# Altium project MSXIV_DC-DC_Converter.PrjPcb
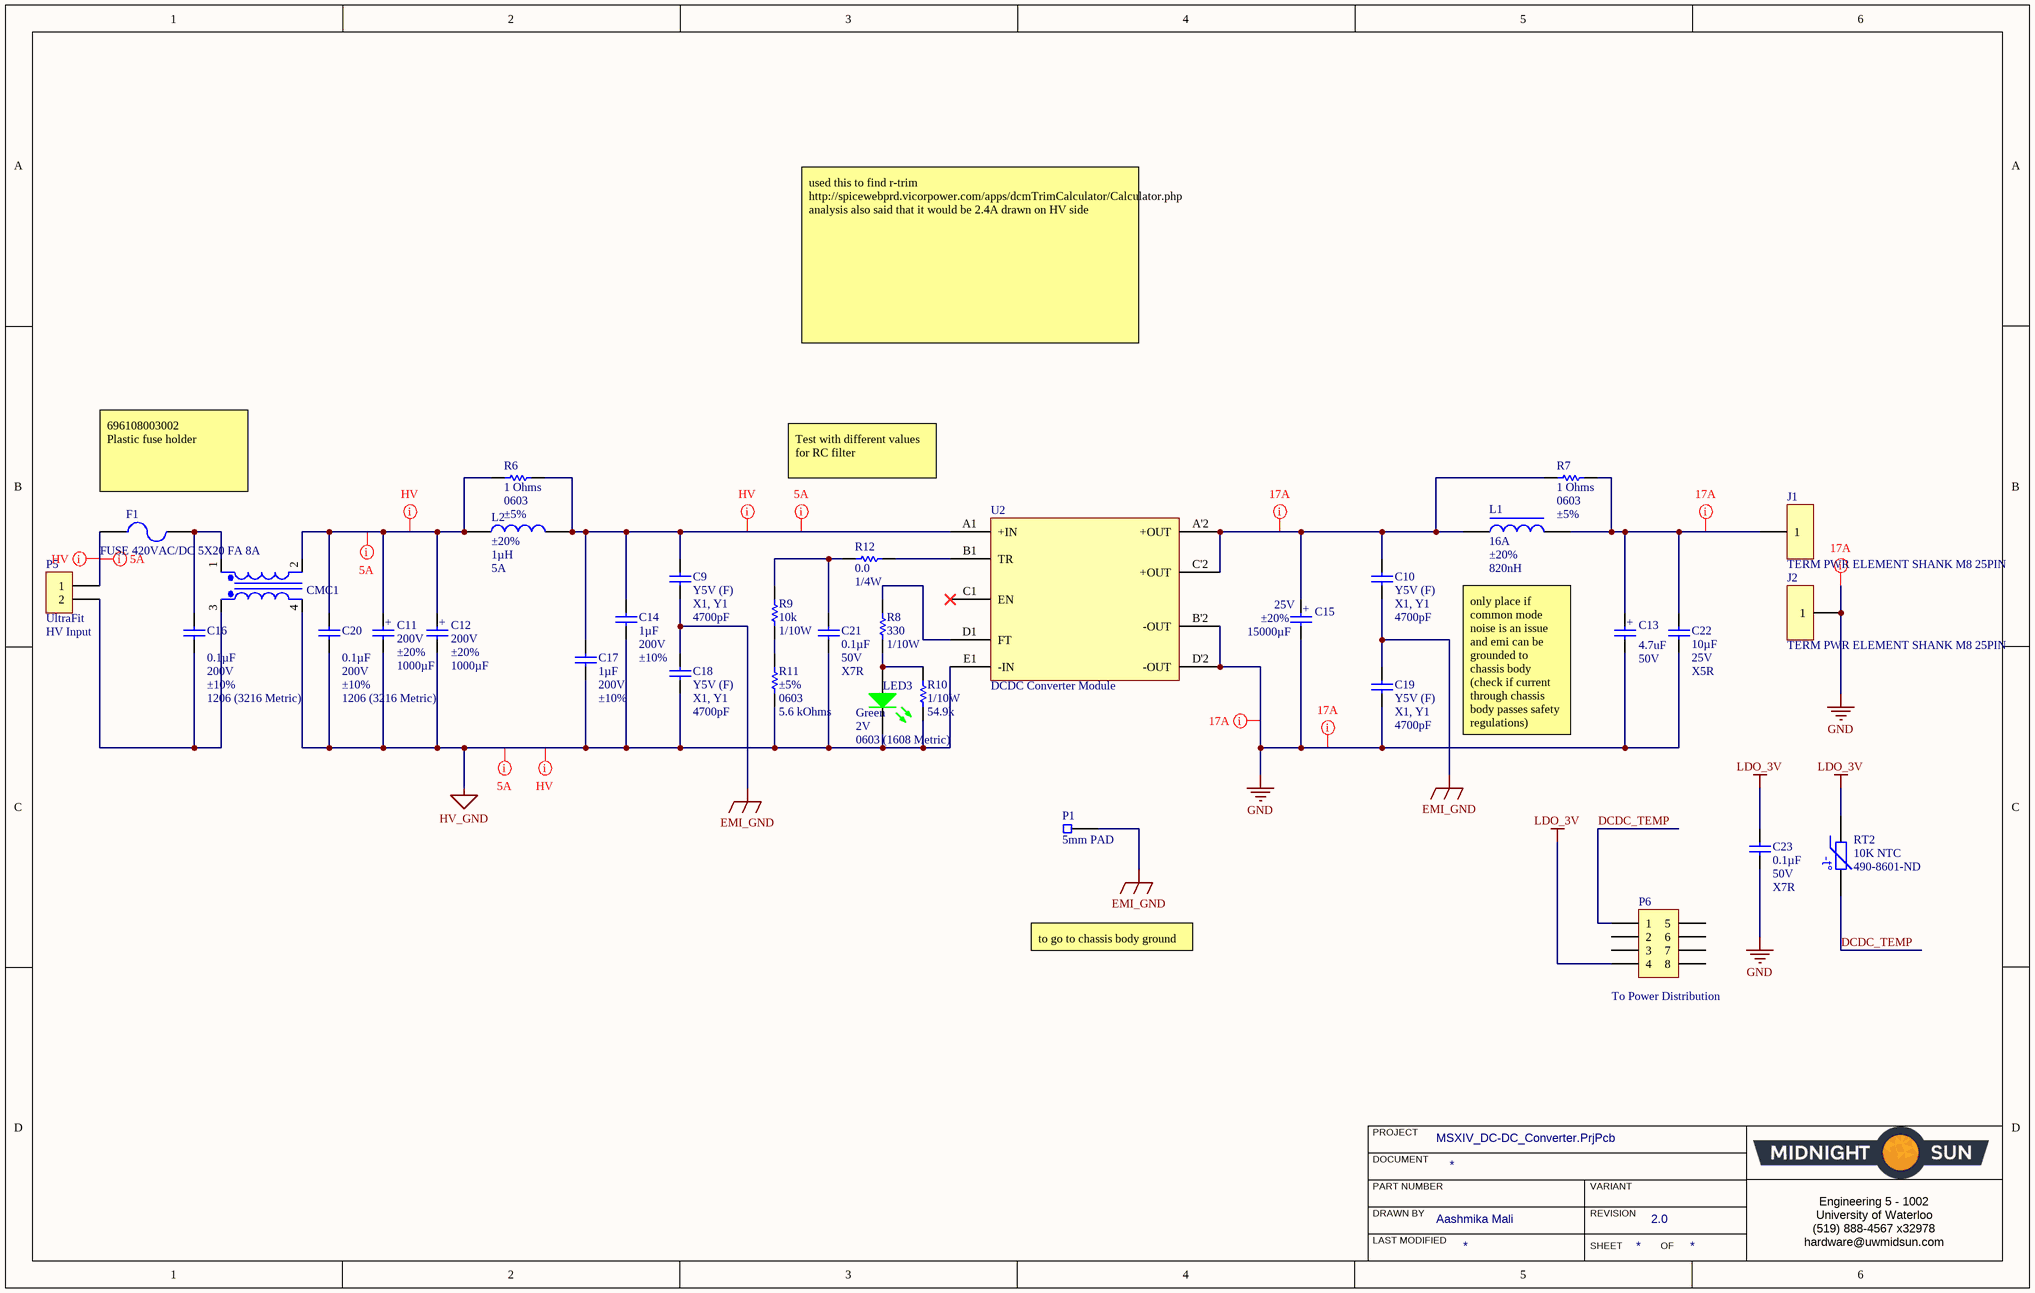
[diagram p0: MSXIV_DC-DC_Converter.SchDoc]
ProjectAuthor: Aashmika Mali; ProjectRevision: 2.0
1 sheet, 34 parts. Net scope: global (net labels, ports and power ports of the same name join across sheets).
Board file: MSXIV_DC-DC_Converter.PcbDoc

## Sheet MSXIV_DC-DC_Converter.SchDoc
size B

### Parts
C9  value 4700pF  Temperature Coefficient: Y5V (F)  Ratings: X1, Y1  [CAP 4700PF 400VAC Y5V RADIAL]  (hidden comment: CAP CER 4700PF 400VAC Y5V RADIAL)
C10  value 4700pF  Temperature Coefficient: Y5V (F)  Ratings: X1, Y1  [CAP 4700PF 400VAC Y5V RADIAL]  (hidden comment: CAP CER 4700PF 400VAC Y5V RADIAL)
C11  Voltage - Rated: 200V  Tolerance: ±20%  Capacitance: 1000µF  [CAP ALUM 1000uF 200V]  (hidden comment: CAP ALUM 1000UF 20% 200V SNAP)
C12  Voltage - Rated: 200V  Tolerance: ±20%  Capacitance: 1000µF  [CAP ALUM 1000uF 200V]  (hidden comment: CAP ALUM 1000UF 20% 200V SNAP)
C13  Capacitance: 4.7uF  Voltage Rating (DC): 50V  [CAP ALUM 6.3MM RADIAL SMD]  (hidden comment: EEE-1HA4R7NP)
C14  Capacitance: 1µF  Voltage - Rated: 200V  Tolerance: ±10%  [CAP, 2220]  (hidden comment: CAP CER 1UF 200V X7R 2220)
C15  Voltage - Rated: 25V  Tolerance: ±20%  Capacitance: 15000µF  [CAP ALUM 1000uF 200V]  (hidden comment: CAP ALUM 15000UF 20% 25V SNAP)
C16  Capacitance: 0.1µF  Voltage - Rated: 200V  Tolerance: ±10%  Package / Case: 1206 (3216 Metric)  [CAP, 1206]  (hidden comment: CAP CER 0.1UF 200V X7R 1206)
C17  Capacitance: 1µF  Voltage - Rated: 200V  Tolerance: ±10%  [CAP, 2220]  (hidden comment: CAP CER 1UF 200V X7R 2220)
C18  value 4700pF  Temperature Coefficient: Y5V (F)  Ratings: X1, Y1  [CAP 4700PF 400VAC Y5V RADIAL]  (hidden comment: CAP CER 4700PF 400VAC Y5V RADIAL)
C19  value 4700pF  Temperature Coefficient: Y5V (F)  Ratings: X1, Y1  [CAP 4700PF 400VAC Y5V RADIAL]  (hidden comment: CAP CER 4700PF 400VAC Y5V RADIAL)
C20  Capacitance: 0.1µF  Voltage - Rated: 200V  Tolerance: ±10%  Package / Case: 1206 (3216 Metric)  [CAP, 1206]  (hidden comment: CAP CER 0.1UF 200V X7R 1206)
C21  Capacitance: 0.1µF  Voltage: 50V  Temperature Coefficient: X7R  [CAP, 0603]  (hidden comment: CAP CER 0.1UF 50V 10% X7R 0603)
C22  Capacitance: 10µF  Voltage: 25V  Temperature Coefficient: X5R  [CAP, 0603]  (hidden comment: CAP CER 10uF 25V 20% X5R 0603)
C23  Capacitance: 0.1µF  Voltage: 50V  Temperature Coefficient: X7R  [CAP, 0603]  (hidden comment: CAP CER 0.1UF 50V 10% X7R 0603)
CMC1  CM Choke  [LCCI 50 Common mode choke]  (value not drawn)
F1  FUSE 420VAC/DC 5X20 FA 8A  [FUSE 420VAC/DC 5X20 FA 8A]
J1  TERM PWR ELEMENT SHANK M8 25PIN  [TERM PWR ELEMENT SHANK M8 25PIN]
J2  TERM PWR ELEMENT SHANK M8 25PIN  [TERM PWR ELEMENT SHANK M8 25PIN]
L1  Current Rating (Amps): 16A  Tolerance: ±20%  Inductance: 820nH  [IND 820NH 16A 6 MOHM SMD]  (hidden comment: IND 820NH 16A 6 MOHM SMD)
L2  Tolerance: ±20%  Inductance: 1µH  Current Rating (Amps): 5A  [IND 1UH 5A 12MOHM SMD]  (hidden comment: IND 1UH 5A 12MOHM SMD)
LED3  Package / Case: 0603 (1608 Metric)  Color: Green  Voltage - Forward (Vf) (Typ): 2V  [LED_0603]  (hidden comment: LED GREEN CLEAR 2V 0603)
P1  5mm PAD  [5mm PAD]
P5  Series: UltraFit  [CONN, 2POS ULTRA-FIT]  (hidden comment: CONN 2POS ULTRA-FIT 0.138")
P6  CONN 8POS ULTRA-FIT 0.138"  [CONN, 8POS ULTRA-FIT]  (value not drawn)
R6  Resistance: 1 Ohms  Supplier Device Package: 0603  Tolerance: ±5%  [RES, 0603]  (hidden comment: RES 1 OHM 5% 1/10W 0603)
R7  Resistance: 1 Ohms  Supplier Device Package: 0603  Tolerance: ±5%  [RES, 0603]  (hidden comment: RES 1 OHM 5% 1/10W 0603)
R8  Resistance: 330  Power: 1/10W  [RES, 0603]  (hidden comment: RES 330 OHM 1% 1/10W 0603)
R9  Resistance: 10k  Power: 1/10W  [RES, 0603]  (hidden comment: RES 10K OHM 1% 1/10W 0603)
R10  Power (Watts): 1/10W  Resistance (Ohms): 54.9k  [RES, 0603]  (hidden comment: RES 54.9K OHM 1% 1/10W 0603)
R11  Tolerance: ±5%  Supplier Device Package: 0603  Resistance: 5.6 kOhms  [RES, 0603]  (hidden comment: RES 15.6K OHM 0.1% 1/10W 0402)
R12  Resistance: 0.0  Power (Watts): 1/4W  [RES, 0603]  (hidden comment: RES 0.0 OHM 1/4W 0603)
RT2  10K NTC  Supplier Part Number 1: 490-8601-ND  [NTC THERMISTOR BEAD]
U2  Type: DCDC Converter Module  [IC, DCDC converter DCM3623TA5N17B4T70]  (hidden comment: DCDC VICOR CONVERTER 15V 240W - DCM3623TA5N17B4T70)

### Nets
EMI_GND: C9.2 C10.2 C18.1 C19.1 P1.1
GND: C13.2 C15.2 C19.2 C22.2 C23.2 J2.1 U2.B'2(-OUT) U2.D'2(-OUT)
HV_GND: C11.2 C12.2 C14.2 C17.2 C18.2 C20.2 C21.2 CMC1.4 LED3.2(K) R10.2 R11.1 U2.E1(-IN)
LDO_3V: C23.1 P6.4 RT2.1
DCDC_TEMP: P6.1 RT2.2
NetC9_1: C9.1 C14.1 C17.1 L2.2 R6.2 U2.A1(+IN)
NetC10_1: C10.1 C15.1 L1.1 R7.1 U2.A'2(+OUT) U2.C'2(+OUT)
NetC11_1: C11.1 C12.1 C20.1 CMC1.2 L2.1 R6.1
NetC13_1: C13.1 C22.1 J1.1 L1.2 R7.2
NetC16_1: C16.1 CMC1.1 F1.2
NetC16_2: C16.2 CMC1.3 P5.2
NetC21_1: C21.1 R9.1 R12.1
NetF1_1: F1.1 P5.1
NetLED3_1: LED3.1(A) R8.2 R10.1
NetR8_1: R8.1 U2.D1(FT)
NetR9_2: R9.2 R11.2
NetR12_2: R12.2 U2.B1(TR)

Not connected (* = marked no-connect by the designer): P6 2 3 5 6 7 8; U2 C1(EN)*

### Layout directives
net class HV: HV_GND, NetC9_1, NetC11_1, NetF1_1
net class 5A: HV_GND, NetC9_1, NetC11_1, NetF1_1
net class 20A: GND, NetC10_1, NetC13_1

### Notes on the sheet
- used this to find r-trim http://spicewebprd.vicorpower.com/apps/dcmTrimCalculator/Calculator.php
  analysis also said that it would be 2.4A drawn on HV side
- (near F1) 696108003002
  Plastic fuse holder
- Test with different values for RC filter
- (near P5) HV Input
- only place if common mode noise is an issue and emi can be grounded to chassis body (check if current through chassis body passes safety regulations)
- to go to chassis body ground
- (near P6) To Power Distribution
- PROJECT
- DOCUMENT
- DRAWN BY
- LAST MODIFIED
- PART NUMBER
- REVISION
- SHEET
- VARIANT
- OF
- Engineering 5 - 1002
  University of Waterloo
  (519) 888-4567 x32978
  hardware@uwmidsun.com
- (in symbol CAP ALUM 4.7UF 20% 50V SMD) +
- (in symbol CAP ALUM 1000UF 20% 200V SNAP) +
- (in symbol CAP ALUM 15000UF 20% 25V SNAP) +
- (in symbol NTC THERMISTOR 10K 1% BEAD) -t°

### Library data of the parts
C9 C10 C18 C19 = CAP CER 4700PF 400VAC Y5V RADIAL: 4700pF ±20% 400VAC Ceramic Capacitor Y5V (F) Radial, Disc; Manufacturer: KEMET; Manufacturer Part Number: C951U472MVVDBA7317; Supplier 1: Digi-Key; RoHS: RoHS Compliant; Category: Capacitors; Stock 1: 9713; Pricing 1: 1=1.12, 10=0.795, 100=0.5234, 500=0.38772 (CAD); Packaging: Cut Tape (CT); Part Status: Active; Tolerance: ±20%; Voltage - Rated: 400VAC; Operating Temperature: -40°C ~ 125°C; Features: -; Applications: Safety; Failure Rate: -; Mounting Type: Through Hole; Package / Case: Radial, Disc; Size / Dimension: 0.472" Dia (12.00mm); Height - Seated (Max): -; Thickness (Max): -; Lead Spacing: 0.394" (10.00mm); Lead Style: Formed Leads - Kinked; ComponentLink1URL: https://search.kemet.com/component-edge/download/datasheet/C951U472MVVDBA7317.pdf; ComponentLink1Description: https://search.kemet.com/component-edge/download/datasheet/C951U472MVVDBA7317.pdf; Supplier Part Number 1: 399-9517-1-ND
C11 C12 = CAP ALUM 1000UF 20% 200V SNAP: CAP RADIAL ALUM 1000UF 20% 200V SNAP; Manufacturer 1: Cornell Dubilier Electronics (CDE); Manufacturer Part Number 1: SLPX102M200C4P3; ESR (Equivalent Series Resistance): 199mOhm @ 120Hz; Polarization: Polar; Supplier 1: Digi-Key; Supplier Part Number 1: 338-1557-ND; Mounting Type: Through Hole; Package / Case: Radial, Can - Snap-In
C13 = CAP ALUM 4.7UF 20% 50V SMD: 4.7µF 50V Aluminum Electrolytic Capacitors Radial, Can - SMD 2000 Hrs @ 85°C; Manufacturer 1: Panasonic; Description 1: CAPACITOR ALUM ELEC, 4.7UF, 50V, 20%, SMD; Ripple Current: 31mA; Tolerance: 20%; Life (Hours): 2000Hour; Supplier 1: Digi-Key; Supplier Part Number 1: PCE4304CT-ND; Manufacturer Part Number 1: EEE-1HA4R7NP; Stock 1: 19771; Pricing 1: 1=0.43, 10=0.302, 100=0.1986, 500=0.1471 (USD); Mount: Surface Mount,PCB; Case/Package: Radial; Min Operating Temperature: -40°C; Max Operating Temperature: 85°C; Voltage Rating: 50V; Ripple Current (AC): 31mA; Packaging: Tape and Reel; Package Quantity: 1; Termination: SMD/SMT; Diameter: 6.3mm; Length: 5.5mm; Height: 5.4mm; Height - Seated (Max): 0.213inch; Width: 650um; Radiation Hardening: No; REACH SVHC: No SVHC; Lead Free: Lead Free; ComponentLink1URL: https://datasheet.ciiva.com/46374/aba0000ce2-46374373.pdf; ComponentLink1Description: https://datasheet.ciiva.com/46374/aba0000ce2-46374373.pdf; ComponentLink2URL: https://datasheet.ciiva.com/14600/70255710-14600343.pdf; ComponentLink2Description: https://datasheet.ciiva.com/14600/70255710-14600343.pdf; ComponentLink3URL: https://datasheet.ciiva.com/17536/aba0000ce2-17536647.pdf; ComponentLink3Description: https://datasheet.ciiva.com/17536/aba0000ce2-17536647.pdf; ComponentLink4URL: https://datasheet.ciiva.com/24027/aba0000ce2-40801-24027083.pdf; ComponentLink4Description: https://datasheet.ciiva.com/24027/aba0000ce2-40801-24027083.pdf; ComponentLink5URL: https://datasheet.ciiva.com/31414/aba0000ce2-31414684.pdf; ComponentLink5Description: https://datasheet.ciiva.com/31414/aba0000ce2-31414684.pdf; ComponentLink6URL: https://datasheet.ciiva.com/14606/70255710-14606079.pdf; ComponentLink6Description: https://datasheet.ciiva.com/14606/70255710-14606079.pdf
C14 C17 = CAP CER 1UF 200V X7R 2220: 1µF ±10% 200V Ceramic Capacitor X7R 2220 (5750 Metric); Manufacturer: Murata Electronics; Manufacturer Part Number 1: GRM55DR72D105KW01L; Mounting Type 1: Surface Mount, MLCC; Supplier 1: Digi-Key; Supplier Part Number 1: 490-14683-1-ND; Temperature Coefficient: X7R; Package / Case: 2220 (5750 Metric); Size / Dimension: 0.224" L x 0.197" W (5.70mm x 5.00mm)
C15 = CAP ALUM 15000UF 20% 25V SNAP: 15000µF 25V Aluminum Electrolytic Capacitors Radial, Can - Snap-In 40mOhm 3000 Hrs @ 105°C; Manufacturer: Cornell Dubilier Electronics (CDE); Manufacturer Part Number: SLP153M025C4P3; Parameter 1: 0.984" Dia (25.00mm); Supplier 1: Digi-Key; Supplier Part Number 1: 338-1470-ND; Size / Dimension: 0.984" Dia (25.00mm)
C16 C20 = CAP CER 0.1UF 200V X7R 1206: Manufacturer 1: Manufacturer; Manufacturer Part Number 1: 885342208002; Supplier 1: Digi-Key; Supplier Part Number 1: 732-12081-1-ND; Temperature Coefficient: X7R
C21 C23 = CAP CER 0.1UF 50V 10% X7R 0603: 0.10µF ±10% 50V Ceramic Capacitor X7R 0603 (1608 Metric); Manufacturer 1: AVX Corporation; Manufacturer Part Number 1: 06035C104KAT2A; Supplier 1: Digi-Key; Supplier Part Number 1: 478-5052-1-ND; Packaging: Cut Tape (CT); Part Status: Active; Operating Temperature: -55°C ~ 125°C; Ratings: -; Mounting Type: Surface Mount, MLCC; Package / Case: 0603 (1608 Metric); Size / Dimension: 0.063" L x 0.032" W (1.60mm x 0.81mm); Height - Seated (Max): -; Thickness (Max): 0.035" (0.90mm); Lead Spacing: -; Lead Style: -; ComponentLink1URL: http://datasheets.avx.com/X7RDielectric.pdf; ComponentLink1Description: http://datasheets.avx.com/X7RDielectric.pdf; Tolerance: ±10%
C22 = CAP CER 10uF 25V 20% X5R 0603: 10µF ±20% 25V Ceramic Capacitor X5R 0603 (1608 Metric); Manufacturer 1: Murata Electronics North America; Manufacturer Part Number 1: GRM188R61E106MA73D; Supplier 1: Digi-Key; Supplier Part Number 1: 490-7202-1-ND; Packaging: Cut Tape (CT); Part Status: Active; Operating Temperature: -55°C ~ 85°C; Ratings: -; Mounting Type: Surface Mount, MLCC; Package / Case: 0603 (1608 Metric); Size / Dimension: 0.063" L x 0.031" W (1.60mm x 0.80mm); Height - Seated (Max): -; Thickness (Max): 0.031" (0.80mm); Lead Spacing: -; Lead Style: -; ComponentLink1URL: http://www.murata.com/~/media/webrenewal/support/library/catalog/products/capacitor/mlcc/c02e.ashx; ComponentLink1Description: http://www.murata.com/~/media/webrenewal/support/library/catalog/products/capacitor/mlcc/c02e.ashx; Tolerance: ±20%
CMC1 = COMMON MODE CHOKE 5.6A 2LN SMD: 2 Line Common Mode Choke Surface Mount  5.6A DCR 21mOhm; PartNumber: P0353NL; Manufacturer 1: Pulse Electronics Power; Manufacturer Part Number 1: P0353NLT; Filter Type: Power Line; Number of Lines: 2; Package: TBD; Supplier 1: Digi-Key; Supplier Part Number 1: 553-1764-1-ND; Current Rating (Max): 5.6A; DC Resistance (DCR) (Max): 21mOhm
F1 = FUSE 420VAC/DC 5X20 FA 8A: 8A 420V AC 420V DC Fuse Cartridge, Ceramic Holder Cartridge, Non-Standard; Manufacturer Part Number: 0487008.MXP; Manufacturer: Littelfuse Inc.; Supplier 1: Digi-Key; Supplier Part Number 1: F6659-ND; Fuse Type: Cartridge, Ceramic; Voltage Rating - DC: 420V
J1 J2 = TERM PWR ELEMENT SHANK M8 25PIN: 25 Pin Shank Terminal M8 Through Hole; Manufacturer Part Number 1: 7460719; Manufacturer 1: Wurth Electronics Inc.; Current Rating (Amps): 250A; Supplier 1: Digi-Key; Supplier Part Number 1: 732-3219-ND; Terminal Type: Shank Terminal; Screw Size: M8; Termination: Press-Fit; Number of Pins: 25
L1 = IND 820NH 16A 6 MOHM SMD: 820nH Shielded Molded Inductor 16A 6mOhm Max Nonstandard; Manufacturer Part Number: ECS-MPIL0630-R82MC; Manufacturer: ECS Inc.; Supplier 1: Digi-Key; Supplier Part Number 1: XC2399CT-ND; Package / Case: Nonstandard; Shielding: Shielded; DC Resistance (DCR): 6mOhm Max; Mounting Type: Surface Mount; Size / Dimension: 0.291" L x 0.260" W (7.40mm x 6.60mm); Height - Seated (Max): 0.118" (3.00mm)
L2 = IND 1uH 5A 12MOHM SMD: 1µH Semi-Shielded Wirewound Inductor 5A 12mOhm Nonstandard; Manufacturer 1: Bourns Inc.; Manufacturer Part Number 1: SRN5040TA-1R0M; Current - Saturation: 7.5A; Shielding: Semi-Shielded; DC Resistance (DCR): 12mOhm; Mounting Type: Surface Mount; Package / Case: Nonstandard; Supplier 1: Digi-Key; Supplier Part Number 1: SRN5040TA-1R0MCT-ND
LED3 = LED GREEN CLEAR 2V 0603: Green 572nm LED Indication - Discrete 2V 0603 (1608 Metric); Manufacturer: Wurth Electronics Inc.; Manufacturer Part Number: 150060VS75000; Lens Color: Colorless; Millicandela Rating: 40mcd; Lens Style/Size: Rectangle with Flat Top, 1.10mm x 0.70mm; Current - Test: 20mA; Viewing Angle: 140°; Wavelength - Dominant: 570nm; Supplier 1: Digi-Key; RoHS: RoHS Compliant; Category: Optoelectronics; Stock 1: 9408; Pricing 1: 1=0.21, 100=0.1617, 500=0.13964 (CAD); Packaging: Cut Tape (CT); Part Status: Active; Lens Transparency: Clear; Mounting Type: Surface Mount; Wavelength - Peak: 572nm; Features: -; Supplier Device Package: 0603; Size / Dimension: 1.60mm L x 0.80mm W; Height (Max): 0.80mm; ComponentLink1URL: http://katalog.we-online.de/led/datasheet/150060VS75000.pdf; ComponentLink1Description: http://katalog.we-online.de/led/datasheet/150060VS75000.pdf; Supplier Part Number 1: 732-4980-1-ND
P1 = 5mm PAD: 5x5mm pad to solder 16 gauge wire
P5 = CONN 2POS ULTRA-FIT 0.138": 2 Positions Header, Shrouded Connector 0.138" (3.50mm) Through Hole Gold; Manufacturer 1: Molex, LLC; Manufacturer Part Number 1: 1722861302; Style: Board to Board or Cable; Shrouding: Shrouded - 4 Wall; Number of Positions: 2; Number of Positions Loaded: All; Contact Length - Post: 0.126" (3.20mm); Material Flammability Rating: UL94 V-0; Mated Stacking Heights: 26.99mm; Voltage: 400V; Supplier 1: Digi-Key; Supplier Part Number 1: WM11673-ND; Packaging: Tray; Part Status: Active; Connector Type: Header; Contact Type: Male Pin; Pitch - Mating: 0.138" (3.50mm); Number of Rows: 1; Row Spacing - Mating: -; Mounting Type: Through Hole; Termination: Kinked Pin, Solder; Fastening Type: Latch Holder; Contact Length - Mating: -; Overall Contact Length: -; Insulation Height: 0.465" (11.80mm); Contact Shape: Square; Contact Finish - Mating: Gold; Contact Finish Thickness - Mating: 30µin (0.76µm); Contact Finish - Post: Tin; Contact Material: Copper Alloy; Insulation Material: Liquid Crystal Polymer (LCP); Operating Temperature: -40°C ~ 120°C; Ingress Protection: -; Insulation Color: Black; Current Rating: -; Contact Finish Thickness - Post: 60µin (1.52µm); ComponentLink1URL: http://www.molex.com/pdm_docs/sd/1722861302_sd.pdf; ComponentLink1Description: http://www.molex.com/pdm_docs/sd/1722861302_sd.pdf
P6 = CONN 8POS ULTRA-FIT 0.138": 8 Positions Header Connector 0.138" (3.50mm) Through Hole Tin; Manufacturer: Molex, LLC; Manufacturer Part Number: 1722991108; Style: Board to Cable/Wire; Shrouding: Shrouded - 4 Wall; Number of Positions: 8; Number of Positions Loaded: All; Row Spacing - Mating: 0.181" (4.60mm); Contact Length - Post: 0.126" (3.20mm); Material Flammability Rating: UL94 V-0; Voltage Rating: 400V; Mated Stacking Heights: 26.99mm; Supplier 1: Digi-Key; RoHS: RoHS Compliant; Category: Connectors, Interconnects; Stock 1: 60; Pricing 1: 1=2.12, 10=1.923, 50=1.7262, 100=1.6478, 250=1.49084, 500=1.37314, 1000=1.17697, 2500=1.0985, 5000=1.04358 (CAD); Packaging: Tray; Part Status: Active; Connector Type: Header; Contact Type: Male Pin; Pitch - Mating: 0.138" (3.50mm); Number of Rows: 2; Mounting Type: Through Hole; Termination: Solder; Fastening Type: Latch Holder; Contact Length - Mating: -; Overall Contact Length: -; Insulation Height: 0.465" (11.80mm); Contact Shape: Square; Contact Finish - Mating: Tin; Contact Finish Thickness - Mating: 60µin (1.52µm); Contact Finish - Post: Tin; Contact Material: Copper Alloy; Insulation Material: Liquid Crystal Polymer (LCP); Features: Board Guide, Solder Retention; Operating Temperature: -40°C ~ 105°C; Ingress Protection: -; Insulation Color: Black; Current Rating: -; Contact Finish Thickness - Post: 60µin (1.52µm); Applications: Automotive, General Purpose, Industrial, Lighting, Medical, Military, Telecommunications; ComponentLink1URL: http://www.molex.com/pdm_docs/sd/1722991108_sd.pdf; ComponentLink1Description: http://www.molex.com/pdm_docs/sd/1722991108_sd.pdf; Supplier Part Number 1: WM11779-ND
R6 R7 = RES 1 OHM 5% 1/10W 0603: RES SMD 1 OHM 5% 1/10W 0603; Manufacturer 1: Rohm Semiconductor; Manufacturer Part Number 1: KTR03EZPJ1R0; Detailed Description: 1 Ohms ±5% 0.1W, 1/10W Chip Resistor 0603 (1608 Metric) Automotive AEC-Q200, High Voltage Thick Film; Power (Watts): 0.1W, 1/10W; Digi-Key Part Number: RHM1.0AZCT-ND; Package / Case: 0603 (1608 Metric); Supplier 1: Digi-Key; Supplier Part Number 1: RHM1.0AZCT-ND
R8 = RES 330 OHM 1% 1/10W 0603: 330 Ohms ±1% 0.1W, 1/10W Chip Resistor 0603 (1608 Metric) Automotive AEC-Q200, Moisture Resistant Thick Film; Manufacturer: TE Connectivity; Manufacturer Part Number: 1-2176339-9; Supplier 1: Digi-Key; Stock 1: 0; Supplier Part Number 1: A129682TR-ND
R9 = RES 10K OHM 1% 1/10W 0603: RES SMD 10K OHM 1% 1/10W 0603; Manufacturer 1: Yageo; Manufacturer Part Number 1: RC0603FR-0710KL; Temperature Coefficient: ±100ppm/°C; Supplier 1: Digi-Key; Supplier Part Number 1: 311-10.0KHRCT-ND; Packaging: Cut Tape (CT); Part Status: Active; Composition: Thick Film; Operating Temperature: -55°C ~ 155°C; Package / Case: 0603 (1608 Metric); Supplier Device Package: 0603; Size / Dimension: 0.063" L x 0.031" W (1.60mm x 0.80mm); Height - Seated (Max): 0.022" (0.55mm); Failure Rate: -; ComponentLink1URL: http://www.yageo.com/documents/recent/PYu-RC_Group_51_RoHS_L_7.pdf; ComponentLink1Description: http://www.yageo.com/documents/recent/PYu-RC_Group_51_RoHS_L_7.pdf; Tolerance: ±1%
R10 = RES 54.9K OHM 1% 1/10W 0603: 54.9k Ohm ±1% 0.1W, 1/10W Chip Resistor 0603 (1608 Metric) Automotive AEC-Q200 Thick Film; Manufacturer: Panasonic Electronic Components; Manufacturer Part Number: ERJ-3EKF5492V; Temperature Coefficient: ±100ppm/°C; Supplier 1: Digi-Key; RoHS: RoHS Compliant; Category: Resistors; Stock 1: 74038; Pricing 1: 1=0.16, 10=0.031, 100=0.0127, 1000=0.00567, 2500=0.00492 (CAD); Packaging: Cut Tape (CT); Part Status: Active; Composition: Thick Film; Features: Automotive AEC-Q200; Operating Temperature: -55°C ~ 155°C; Package / Case: 0603 (1608 Metric); Supplier Device Package: 0603; Size / Dimension: 0.063" L x 0.031" W (1.60mm x 0.80mm); Height - Seated (Max): 0.022" (0.55mm); Failure Rate: -; ComponentLink1URL: https://industrial.panasonic.com/cdbs/www-data/pdf/RDA0000/AOA0000C298.pdf; ComponentLink1Description: https://industrial.panasonic.com/cdbs/www-data/pdf/RDA0000/AOA0000C298.pdf; Supplier Part Number 1: P54.9KHCT-ND; Tolerance: ±1%
R11 = RES 5.6K OHM 5% 1/10W 0603: 5.6 kOhms ±5% 0.1W, 1/10W Chip Resistor 0603 (1608 Metric) Moisture Resistant Thick Film; Manufacturer Part Number 1: RC0603JR-075K6L; Manufacturer 1: Yageo; Supplier 1: Digi-Key; Supplier Part Number 1: 311-5.6KGRCT-ND
R12 = RES 0.0 OHM 1/4W 0603: RES SMD 0.0 OHM JUMPER 1/4W 0603; Manufacturer 1: Vishay Dale; Manufacturer Part Number 1: CRCW06030000Z0EAHP; Supplier 1: Digi-Key; Supplier Part Number 1: 541-0.0SBCT-ND; Packaging: Cut Tape (CT); Part Status: Active; Composition: Thick Film; Operating Temperature: -55°C ~ 155°C; Package / Case: 0603 (1608 Metric); Supplier Device Package: 0603; Size / Dimension: 0.063" L x 0.033" W (1.60mm x 0.85mm); Height - Seated (Max): 0.022" (0.55mm); Failure Rate: -; ComponentLink1URL: http://www.vishay.com/docs/20043/crcwhpe3.pdf; ComponentLink1Description: http://www.vishay.com/docs/20043/crcwhpe3.pdf
RT2 = NTC THERMISTOR 10K 1% BEAD: NTC Thermistor 10k Bead; Manufacturer: Murata Electronics North America; Manufacturer Part Number: NXRT15XH103FA1B030; Resistance Tolerance: ±1%; B25/50: 3380K; B25/85: 3434K; B25/100: 3455K; Supplier 1: Digi-Key; RoHS: RoHS Compliant; Category: Sensors, Transducers; Stock 1: 25017; Pricing 1: 1=0.96, 5=0.91, 10=0.792, 25=0.696, 50=0.5784, 100=0.4925, 500=0.42834, 1000=0.3748, 5000=0.33197 (CAD); Packaging: Bulk; Part Status: Active; Resistance in Ohms @ 25°C: 10k; B Value Tolerance: ±1%; B0/50: -; B25/75: -; Operating Temperature: -40°C ~ 125°C; Length - Lead Wire: -; Mounting Type: Through Hole; Package / Case: Bead; ComponentLink1URL: https://www.murata.com/~/media/webrenewal/support/library/catalog/products/thermistor/ntc/r44e.ashx; ComponentLink1Description: https://www.murata.com/~/media/webrenewal/support/library/catalog/products/thermistor/ntc/r44e.ashx
U2 = DCDC VICOR CONVERTER 15V 240W - DCM3623TA5N17B4T70: DC DC CONVERTER 15V 240W; Manufacturer 1: Vicor Corporation; Number of Outputs: 1; Voltage - Input (Min): 154V; Voltage - Input (Max): 43V; Current - Output (Max): 16A; Efficiency: 92.1%; Supplier 1: Digi-Key; Supplier Part Number 1: 1470-2950-1-ND; Manufacturer Part Number 1: DCM3623TA5N17B4T70; Packaging: Cut Tape (CT); Part Status: Active; Voltage - Output 1: 15V; Voltage - Output 2: -; Voltage - Output 3: -; Operating Temperature: -40°C ~ 105°C; Mounting Type: Surface Mount; Package / Case: 9-DIP Module; Size / Dimension: 1.52" L x 0.90" W x 0.28" H (38.72mm x 22.8mm x 7.2mm); ComponentLink1URL: http://www.vicorpower.com/documents/datasheets/DCM3623xA5N17B4y7z_ds.pdf; ComponentLink1Description: http://www.vicorpower.com/documents/datasheets/DCM3623xA5N17B4y7z_ds.pdf; Power: 240W

## Assembly variants
Variant of MSXIV_DC-DC_Converter: not fitted C10 C19